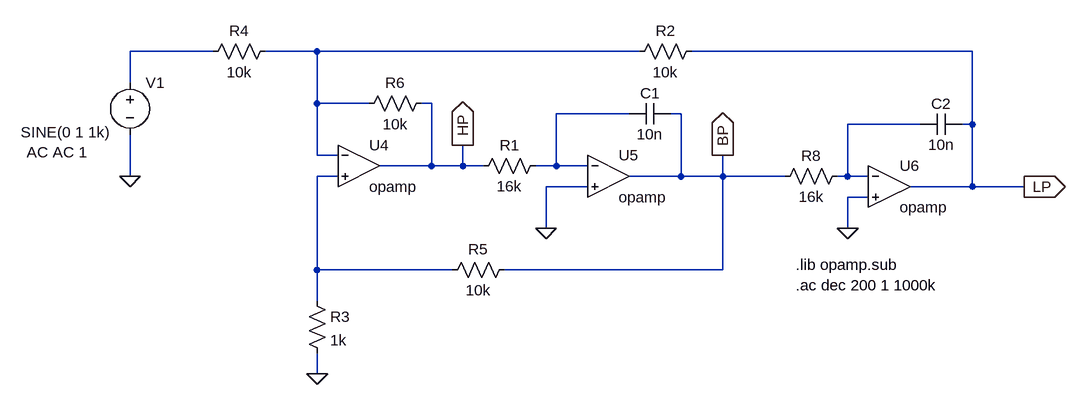
[diagram p0: schematic State-variable filter EN195.asc]
State-variable filter EN195.asc, the LTspice schematic file:
Version 4
SHEET 1 1688 680
WIRE -176 -64 -304 -64
WIRE -16 -64 -96 -64
WIRE 480 -64 -16 -64
WIRE 992 -64 560 -64
WIRE -304 -16 -304 -64
WIRE -16 16 -16 -64
WIRE 64 16 -16 16
WIRE 160 16 144 16
WIRE 464 32 352 32
WIRE 544 32 528 32
WIRE 912 48 800 48
WIRE 992 48 992 -64
WIRE 992 48 976 48
WIRE -16 96 -16 16
WIRE 16 96 -16 96
WIRE 160 112 160 16
WIRE 160 112 80 112
WIRE 208 112 208 80
WIRE 208 112 160 112
WIRE 240 112 208 112
WIRE 352 112 352 32
WIRE 352 112 320 112
WIRE 400 112 352 112
WIRE -304 128 -304 64
WIRE 16 128 -16 128
WIRE 544 128 544 32
WIRE 544 128 464 128
WIRE 608 128 608 96
WIRE 608 128 544 128
WIRE 704 128 608 128
WIRE 800 128 800 48
WIRE 800 128 784 128
WIRE 832 128 800 128
WIRE 400 144 336 144
WIRE 992 144 992 48
WIRE 992 144 896 144
WIRE 1072 144 992 144
WIRE 832 160 800 160
WIRE 336 208 336 144
WIRE 800 208 800 160
WIRE -16 272 -16 128
WIRE 192 272 -16 272
WIRE 608 272 608 128
WIRE 608 272 272 272
WIRE -16 320 -16 272
WIRE -16 432 -16 400
FLAG -304 128 0
FLAG 336 208 0
FLAG 800 208 0
FLAG 1072 144 LP
IOPIN 1072 144 Out
FLAG 608 96 BP
IOPIN 608 96 Out
FLAG -16 432 0
FLAG 208 80 HP
IOPIN 208 80 Out
SYMBOL res -80 -80 R90
WINDOW 0 0 56 VBottom 2
WINDOW 3 32 56 VTop 2
SYMATTR InstName R4
SYMATTR Value 10k
SYMBOL res 288 256 R90
WINDOW 0 0 56 VBottom 2
WINDOW 3 32 56 VTop 2
SYMATTR InstName R5
SYMATTR Value 10k
SYMBOL res 160 0 R90
WINDOW 0 0 56 VBottom 2
WINDOW 3 32 56 VTop 2
SYMATTR InstName R6
SYMATTR Value 10k
SYMBOL res 800 112 R90
WINDOW 0 0 56 VBottom 2
WINDOW 3 32 56 VTop 2
SYMATTR InstName R8
SYMATTR Value 16k
SYMBOL res 336 96 R90
WINDOW 0 0 56 VBottom 2
WINDOW 3 32 56 VTop 2
SYMATTR InstName R1
SYMATTR Value 16k
SYMBOL cap 528 16 R90
WINDOW 0 0 32 VBottom 2
WINDOW 3 32 32 VTop 2
SYMATTR InstName C1
SYMATTR Value 10n
SYMBOL cap 976 32 R90
WINDOW 0 0 32 VBottom 2
WINDOW 3 32 32 VTop 2
SYMATTR InstName C2
SYMATTR Value 10n
SYMBOL voltage -304 -32 R0
WINDOW 3 -168 92 Left 2
WINDOW 123 -159 123 Left 2
WINDOW 39 0 0 Left 0
SYMATTR Value SINE(0 1 1k)
SYMATTR Value2 AC AC 1
SYMATTR InstName V1
SYMBOL res 576 -80 R90
WINDOW 0 0 56 VBottom 2
WINDOW 3 32 56 VTop 2
SYMATTR InstName R2
SYMATTR Value 10k
SYMBOL OpAmps\\opamp 48 48 R0
SYMATTR InstName U4
SYMBOL OpAmps\\opamp 432 64 R0
SYMATTR InstName U5
SYMBOL OpAmps\\opamp 864 80 R0
SYMATTR InstName U6
SYMBOL res -32 304 R0
SYMATTR InstName R3
SYMATTR Value 1k
TEXT 720 296 Left 2 !.ac dec 200 1 1000k
TEXT 720 264 Left 2 !.lib opamp.sub

The netlist it stands for:
* State-variable filter EN195.asc
R4 N002 N001 10k
R5 BP N005 10k
R6 HP N002 10k
R8 N004 BP 16k
R1 N003 HP 16k
C1 BP N003 10n
C2 LP N004 10n
V1 N001 0 SINE(0 1 1k) AC AC 1
R2 LP N002 10k
XU4 N002 N005 HP opamp Aol=100K GBW=10Meg  ; pins invin noninvin out
XU5 N003 0 BP opamp Aol=100K GBW=10Meg  ; pins invin noninvin out
XU6 N004 0 LP opamp Aol=100K GBW=10Meg  ; pins invin noninvin out
R3 N005 0 1k
.ac dec 200 1 1000k
.lib opamp.sub
.backanno
.end

* Results of the author's LTspice run, read from the files saved beside the schematic
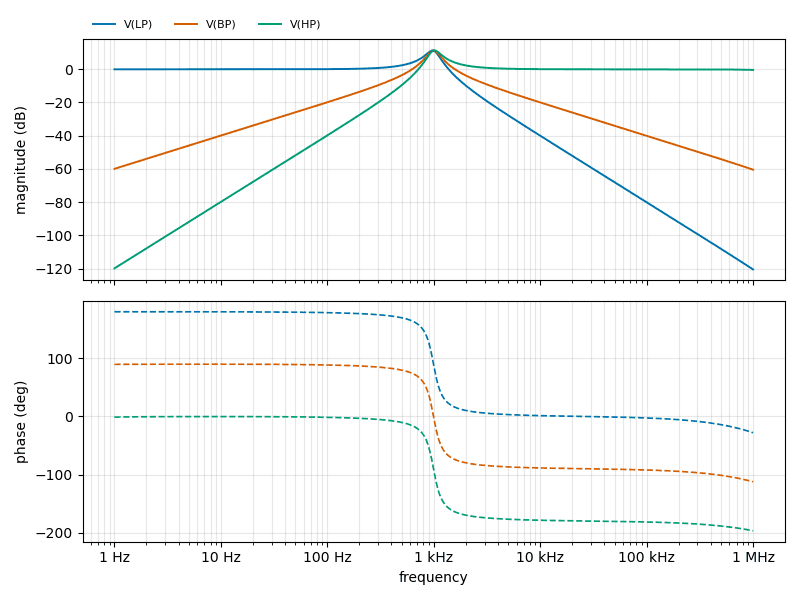
[diagram p1: AC Analysis of State-variable filter EN195.asc, plotted from the saved traces]
* AC Analysis, 1 run:
*   V(LP): -0.00 dB at 1 Hz, -120.55 dB at 1 MHz, peak 11.38 dB at 977.2 Hz, 3 dB below the peak at 828.1 Hz and 1.104 kHz
*   V(BP): -59.95 dB at 1 Hz, -60.46 dB at 1 MHz, peak 11.29 dB at 1 kHz, 3 dB below the peak at 868.2 Hz and 1.139 kHz
*   V(HP): -119.91 dB at 1 Hz, -0.37 dB at 1 MHz, peak 11.38 dB at 1.012 kHz, 3 dB below the peak at 895.9 Hz and 1.195 kHz